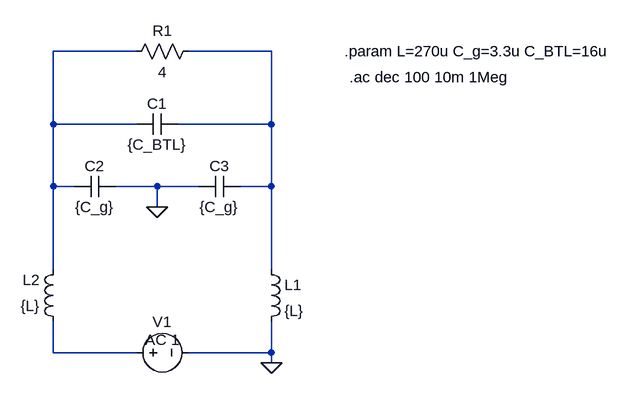
[diagram p0: schematic FinalOutputFilter.asc]
FinalOutputFilter.asc, the LTspice schematic file:
Version 4
SHEET 1 940 680
WIRE 176 0 48 0
WIRE 384 0 256 0
WIRE 48 112 48 0
WIRE 176 112 48 112
WIRE 384 112 384 0
WIRE 384 112 240 112
WIRE 48 208 48 112
WIRE 80 208 48 208
WIRE 208 208 144 208
WIRE 272 208 208 208
WIRE 384 208 384 112
WIRE 384 208 336 208
WIRE 208 240 208 208
WIRE 48 336 48 208
WIRE 384 336 384 208
WIRE 48 464 48 416
WIRE 176 464 48 464
WIRE 384 464 384 416
WIRE 384 464 256 464
WIRE 384 480 384 464
FLAG 208 240 0
FLAG 384 480 0
SYMBOL res 272 -16 R90
WINDOW 0 0 56 VBottom 2
WINDOW 3 32 56 VTop 2
SYMATTR InstName R1
SYMATTR Value 4
SYMBOL cap 240 96 R90
WINDOW 0 0 32 VBottom 2
WINDOW 3 32 32 VTop 2
SYMATTR InstName C1
SYMATTR Value {C_BTL}
SYMBOL cap 144 192 R90
WINDOW 0 0 32 VBottom 2
WINDOW 3 32 32 VTop 2
SYMATTR InstName C2
SYMATTR Value {C_g}
SYMBOL cap 336 192 R90
WINDOW 0 0 32 VBottom 2
WINDOW 3 32 32 VTop 2
SYMATTR InstName C3
SYMATTR Value {C_g}
SYMBOL ind 368 320 R0
SYMATTR InstName L1
SYMATTR Value {L}
SYMBOL ind 64 432 R180
WINDOW 0 36 80 Left 2
WINDOW 3 36 40 Left 2
SYMATTR InstName L2
SYMATTR Value {L}
SYMBOL voltage 160 464 R270
WINDOW 0 32 56 VTop 2
WINDOW 3 -32 56 VBottom 2
WINDOW 123 4 56 VTop 2
WINDOW 39 0 0 Left 0
SYMATTR InstName V1
SYMATTR Value ""
SYMATTR Value2 AC 1
TEXT 496 0 Left 2 !.param L=270u C_g=3.3u C_BTL=16u
TEXT 504 40 Left 2 !.ac dec 100 10m 1Meg

The netlist it stands for:
* FinalOutputFilter.asc
R1 N002 N001 4
C1 N002 N001 {C_BTL}
C2 0 N001 {C_g}
C3 N002 0 {C_g}
L1 N002 0 {L}
L2 N003 N001 {L}
V1 N003 0 AC 1
.param L=270u C_g=3.3u C_BTL=16u
.ac dec 100 10m 1Meg
.backanno
.end